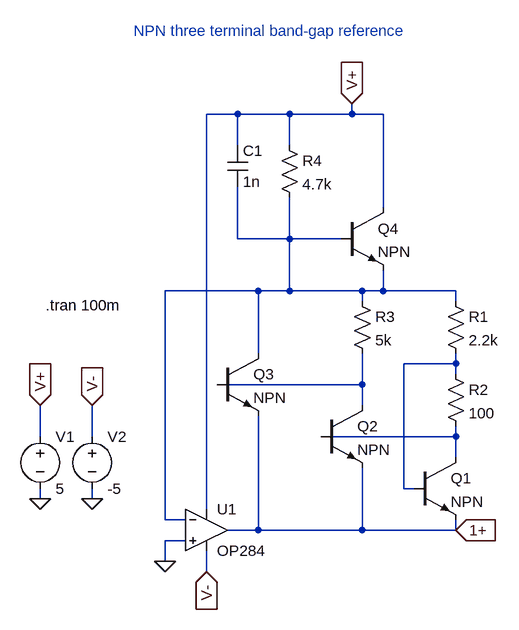
[diagram p0: schematic npn3_shunt_bandgap_reference.asc]
npn3_shunt_bandgap_reference.asc, the LTspice schematic file:
Version 4
SHEET 1 880 680
WIRE 80 -192 32 -192
WIRE 160 -192 80 -192
WIRE 256 -192 256 -208
WIRE 256 -192 160 -192
WIRE 304 -192 256 -192
WIRE 80 -144 80 -192
WIRE 160 -144 160 -192
WIRE 304 -48 304 -192
WIRE 80 0 80 -80
WIRE 160 0 160 -64
WIRE 160 0 80 0
WIRE 240 0 160 0
WIRE 112 80 -32 80
WIRE 160 80 160 0
WIRE 160 80 112 80
WIRE 272 80 160 80
WIRE 304 80 304 48
WIRE 304 80 272 80
WIRE 416 80 304 80
WIRE 272 96 272 80
WIRE 416 96 416 80
WIRE 112 176 112 80
WIRE 416 192 416 176
WIRE 416 192 336 192
WIRE 416 208 416 192
WIRE 272 224 272 176
WIRE 272 224 48 224
WIRE 272 256 272 224
WIRE -224 304 -224 256
WIRE -144 304 -144 256
WIRE 416 304 416 288
WIRE 416 304 208 304
WIRE 416 336 416 304
WIRE 336 384 336 192
WIRE 352 384 336 384
WIRE -224 400 -224 384
WIRE -144 400 -144 384
WIRE 32 416 32 -192
WIRE -32 432 -32 80
WIRE 0 432 -32 432
WIRE 112 448 112 272
WIRE 112 448 64 448
WIRE 272 448 272 352
WIRE 272 448 112 448
WIRE 416 448 416 432
WIRE 416 448 272 448
WIRE 0 464 -32 464
WIRE -32 496 -32 464
WIRE 32 512 32 480
FLAG -224 400 0
FLAG -224 256 V+
IOPIN -224 256 In
FLAG -144 400 0
FLAG -144 256 V-
IOPIN -144 256 In
FLAG -32 496 0
FLAG 32 512 V-
IOPIN 32 512 In
FLAG 256 -208 V+
IOPIN 256 -208 In
FLAG 416 448 1+
IOPIN 416 448 In
SYMBOL voltage -224 288 R0
WINDOW 123 0 0 Left 0
WINDOW 39 0 0 Left 0
SYMATTR InstName V1
SYMATTR Value 5
SYMBOL voltage -144 288 R0
WINDOW 123 0 0 Left 0
WINDOW 39 0 0 Left 0
SYMATTR InstName V2
SYMATTR Value -5
SYMBOL Opamps\\OP284 32 384 R0
SYMATTR InstName U1
SYMBOL res 400 80 R0
SYMATTR InstName R1
SYMATTR Value 2.2k
SYMBOL res 400 192 R0
SYMATTR InstName R2
SYMATTR Value 100
SYMBOL res 256 80 R0
SYMATTR InstName R3
SYMATTR Value 5k
SYMBOL res 144 -160 R0
SYMATTR InstName R4
SYMATTR Value 4.7k
SYMBOL npn 352 336 R0
SYMATTR InstName Q1
SYMBOL npn 208 256 R0
SYMATTR InstName Q2
SYMBOL npn 48 176 R0
SYMATTR InstName Q3
SYMBOL npn 240 -48 R0
SYMATTR InstName Q4
SYMBOL cap 64 -144 R0
SYMATTR InstName C1
SYMATTR Value 1n
TEXT -216 102 Left 2 !.tran 100m
TEXT -80 -320 Left 2 ;NPN three terminal band-gap reference

The netlist it stands for:
* npn3_shunt_bandgap_reference.asc
V1 V+ 0 5
V2 V- 0 -5
XU1 0 N001 V+ V- 1+ OP284  ; pins In+ In- V+ V- OUT
R1 N001 N002 2.2k
R2 N002 N004 100
R3 N001 N003 5k
R4 V+ N001 4.7k
Q1 N004 N002 1+ 0 NPN
Q2 N003 N004 1+ 0 NPN
Q3 N001 N003 1+ 0 NPN
Q4 V+ N001 N001 0 NPN
C1 V+ N001 1n
.model NPN NPN
.model PNP PNP
.lib standard.bjt
.tran 100m
* NPN three terminal band-gap reference
.lib ADI1.lib
.backanno
.end